# EAGLE design klingel_tueroeffner (EAGLE 6.2)
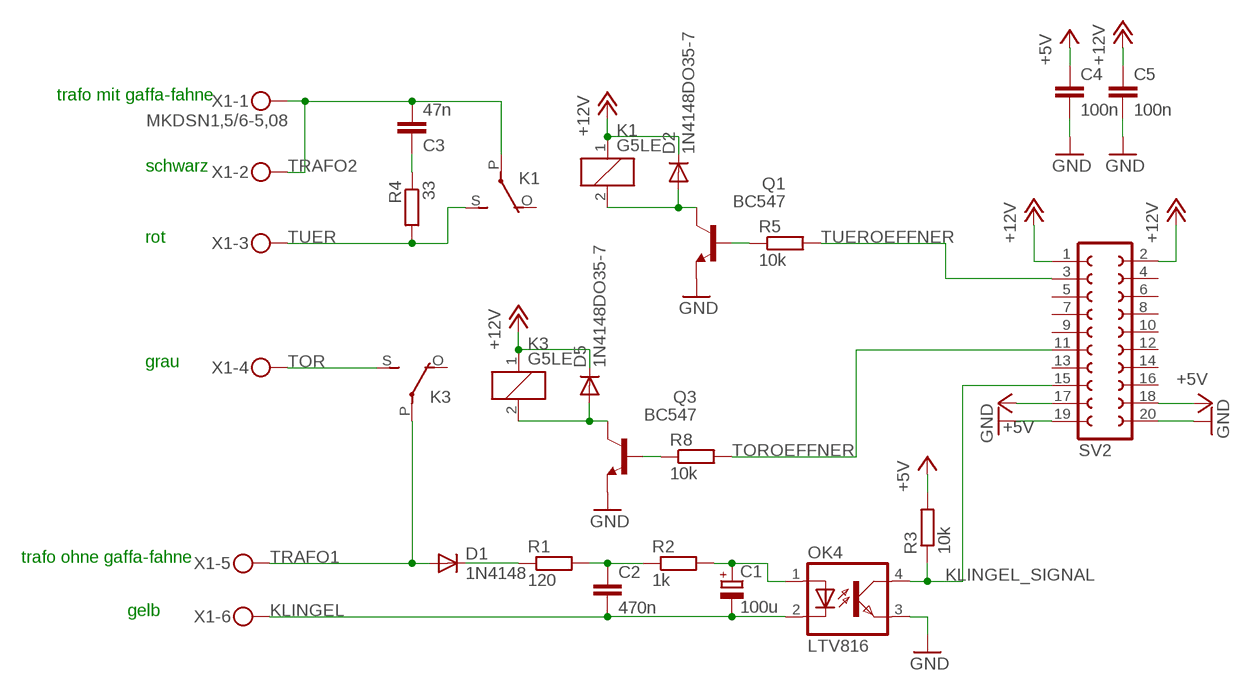
[diagram p0: schematic, sheet 1]

## Parts
C1  100u  CPOL-EUE2.5-6  [E2,5-6]
C2  470n  C-EU050-030X075  [C050-030X075]
C3  47n  C-EUC1206  [C1206]
C4  100n  C-EUC0805  [C0805]
C5  100n  C-EUC0805  [C0805]
D1  1N4148  1N4148DO35-7  [DO35-7]
D2  1N4148DO35-7  [DO35-7]
D5  1N4148DO35-7  [DO35-7]
K1  G5LE  [G5LE]
K3  G5LE  [G5LE]
OK4  LTV816  [DIL04]
Q1  BC547  [TO92]
Q3  BC547  [TO92]
R1  120  R-EU_R1206  [R1206]
R2  1k  R-EU_R1206  [R1206]
R3  10k  R-EU_R0805  [R0805]
R4  33  R-EU_R1206  [R1206]
R5  10k  R-EU_0204/7  [0204/7]
R8  10k  R-EU_R0805  [R0805]
SV2  FE10-2  [FE10-2]
X1  MKDSN1,5/6-5,08  [MKDSN1,5/6-5,08]

## Nets
+5V: C4.1 R3.2 SV2.17 SV2.18
+12V: C5.1 D2.C D5.C K1.1 K3.1 SV2.1 SV2.2
GND: C4.2 C5.2 OK4.3(EMIT) Q1.1(E) Q3.1(E) SV2.19 SV2.20
KLINGEL: C1.- C2.2 OK4.2(C) X1.6
KLINGEL_SIGNAL: OK4.4(COL) R3.1 SV2.15
N$2: C1.+ OK4.1(A) R2.2
N$4: D1.C R1.1
N$5: C2.1 R1.2 R2.1
N$6: C3.1 R4.1
N$9: Q1.2(B) R5.1
N$10: D2.A K1.2 Q1.3(C)
N$21: Q3.2(B) R8.1
N$22: D5.A K3.2 Q3.3(C)
TOR: K3.S(2:S) X1.4
TOROEFFNER: R8.2 SV2.11
TRAFO1: D1.A K3.P(2:P) X1.5
TRAFO2: C3.2 K1.P(2:P) X1.1 X1.2
TUER: K1.S(2:S) R4.2 X1.3
TUEROEFFNER: R5.2 SV2.3
Unconnected: K1.O(2:O) K3.O(2:O) SV2.4 SV2.5 SV2.6 SV2.7 SV2.8 SV2.9 SV2.10 SV2.12 SV2.13 SV2.14 SV2.16

## Notes on the sheet
- trafo mit gaffa-fahne
- schwarz
- rot
- grau
- trafo ohne gaffa-fahne
- gelb

## Library data of the parts
C1 = rcl:CPOL-EU: POLARIZED CAPACITOR, European symbol
C2-C5 = rcl:C-EU: CAPACITOR, European symbol
D1 D2 D5 = diode:1N4148: DIODE high speed (Philips)
K1 K3 = relay:G5LE: RELAY 1 x switch, 10 A/120 V AC, 8 A/30 V DC, Omron; OC_FARNELL: unknown; OC_NEWARK: unknown
OK4 = optocoupler:LTV816: OPTO COUPLER Source: LITEON, LTV816.pdf; OC_FARNELL: unknown; OC_NEWARK: unknown
Q1 Q3 = transistor-npn:BC547*: NPN Transistor
R1-R5 R8 = rcl:R-EU_: RESISTOR, European symbol
SV2 = con-lsta:FE10-2: FEMALE HEADER; OC_FARNELL: unknown; OC_NEWARK: unknown
X1 = con-phoenix-508:MKDSN1,5/6-5,08: MKDSN 1,5/ 6-5,08 Printklemme Nennstrom: 13,5 A Nennspannung: 250 V Rastermaß: 5,08 mm Polzahl: 6 Anschlussart: Schraubanschluss Montage: Löten Anschlussrichtung Leiter/Platine: 0 ° Artikelnummer: 1729160 Source: http://eshop.phoenixcontact.com .. 1729160.pdf; MPN: SMKDSN1,5/6-5,08; OC_FARNELL: 1792907; OC_NEWARK: 70R0302

## Board
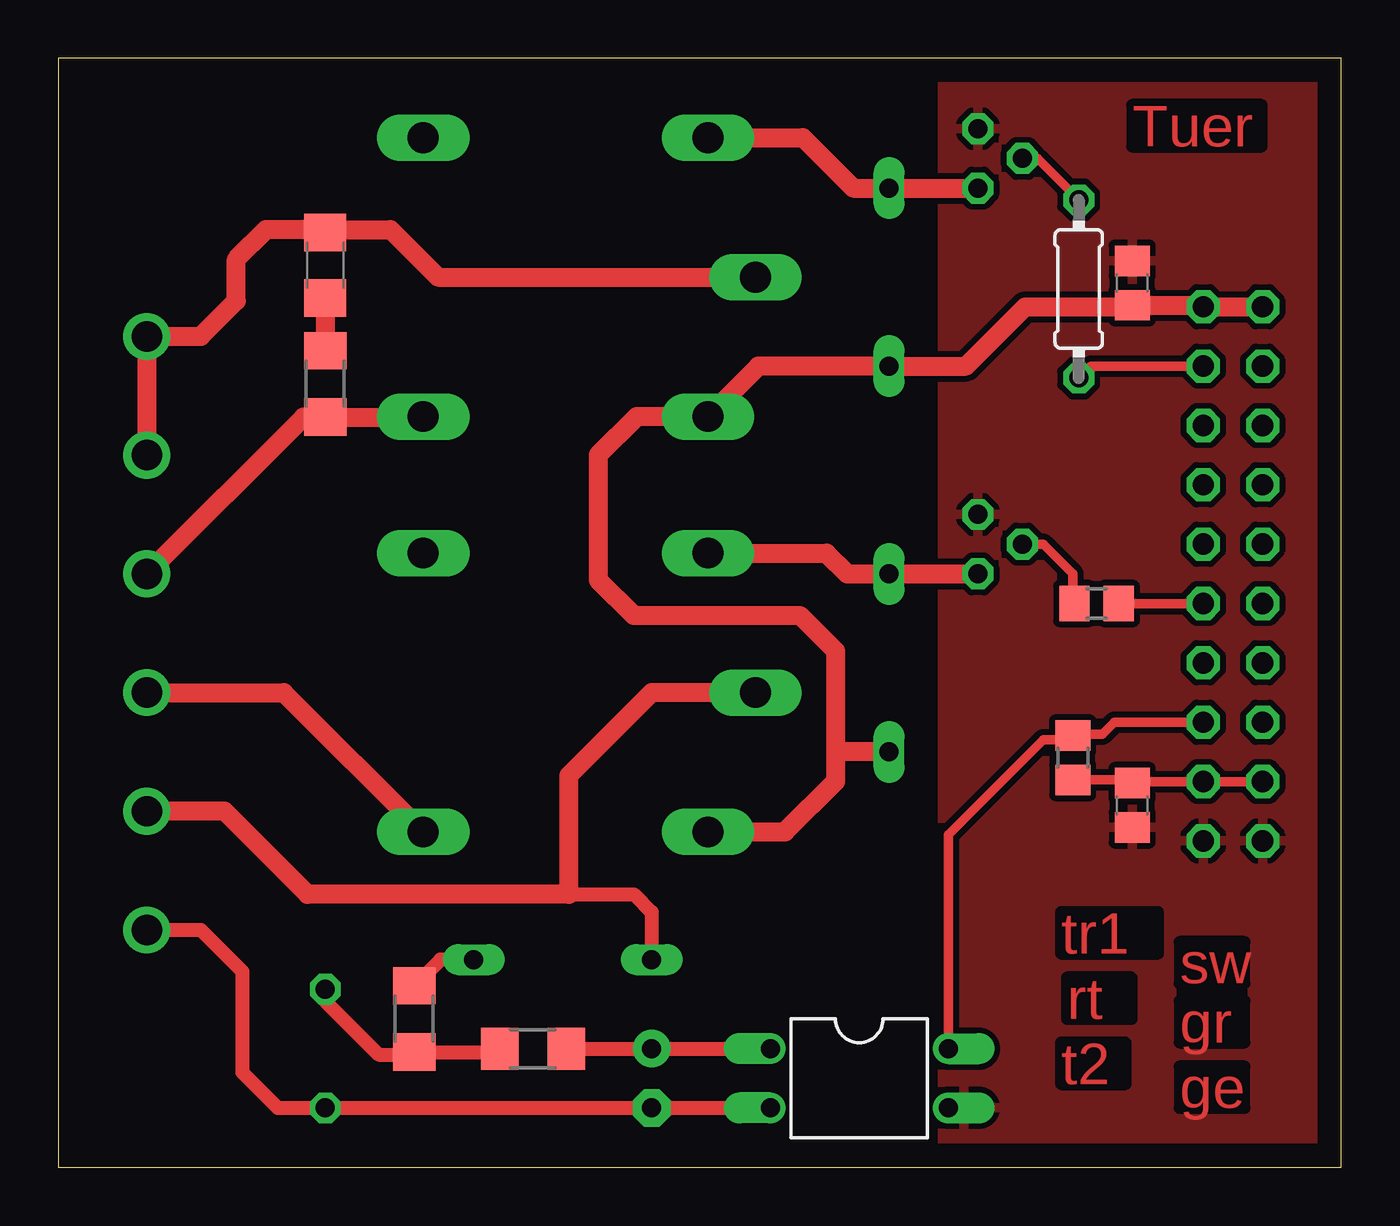
[diagram p1: board, top side]
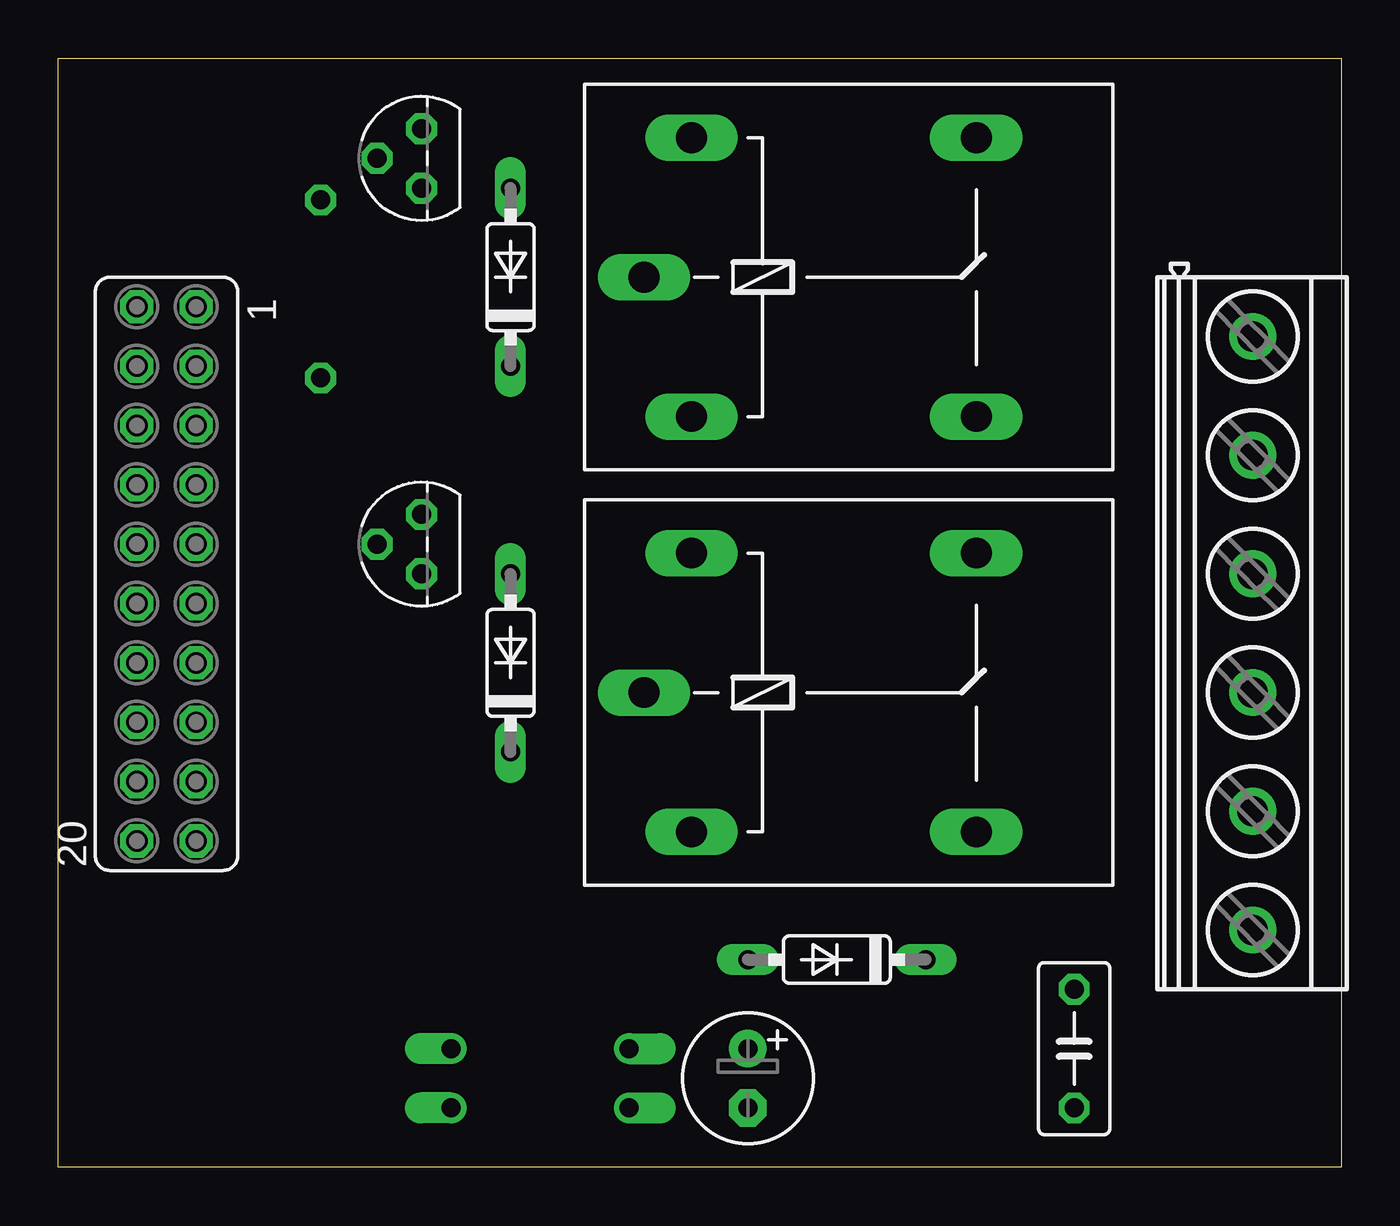
[diagram p2: board, bottom side, seen from below]

Size 54.92 x 47.46 mm. Coordinates in mm from the lower left corner, seen from the top.
Outline: 0,0 54.92,0 54.92,47.46 0,47.46 0,0
Copper layers (1*16): Top 0.035mm / dielectric 1.5mm / Bottom 0.035mm
Design rules: minimum track width 10mil, minimum drill 24mil, track to track 8mil, track to pad 8mil, pad to pad 8mil, via to via 8mil, smd to smd 8mil, copper to edge 40mil, drill to drill 8mil, minimum pad ring 10mil, minimum via ring 8mil, stop-mask expansion 4mil, vias tented up to drill 0mil, thermal gap 10mil

### Footprints (pad centres in the part's own frame; a part is rotated, then mirrored left to right if it is on the bottom)
E2,5-6 = drill 0.813 pad 1.6: + -1.27,0 | drill 0.813 pad 1.6 octagon: - 1.27,0
C050-030X075 = drill 0.813 octagon: 1 -2.54,0; 2 2.54,0
C1206 = smd 1.6 x 1.8: 1 -1.4,0; 2 1.4,0
C0805 = smd 1.3 x 1.5: 1 -0.95,0; 2 0.95,0
DO35-7 = drill 0.813 long: A 3.81,0; C -3.81,0
G5LE = drill 1.321 long: 1 -7.493,-5.969; 2 -7.493,5.969; O 4.699,5.969; P -9.525,0; S 4.699,-5.969
DIL04 = drill 0.813 offset: 1 -1.27,-3.81; 2 1.27,-3.81; 3 1.27,3.81; 4 -1.27,3.81
TO92 = drill 0.813 octagon: 1 1.27,0; 2 0,1.905; 3 -1.27,0
R1206 = smd 1.6 x 1.803: 1 -1.422,0; 2 1.422,0
R0805 = smd 1.3 x 1.5: 1 -0.95,0; 2 0.95,0
0204/7 = drill 0.813 octagon: 1 -3.81,0; 2 3.81,0
FE10-2 = drill 0.914 octagon: 1 -11.43,1.27; 2 -11.43,-1.27; 3 -8.89,1.27; 4 -8.89,-1.27; 5 -6.35,1.27; 6 -6.35,-1.27; 7 -3.81,1.27; 8 -3.81,-1.27; 9 -1.27,1.27; 10 -1.27,-1.27; 11 1.27,1.27; 12 1.27,-1.27; 13 3.81,1.27; 14 3.81,-1.27; 15 6.35,1.27; 16 6.35,-1.27; 17 8.89,1.27; 18 8.89,-1.27; 19 11.43,1.27; 20 11.43,-1.27
MKDSN1,5/6-5,08 = drill 1.3 pad 2: 1 -12.7,0.025; 2 -7.62,0.025; 3 -2.54,0.025; 4 2.54,0.025; 5 7.62,0.025; 6 12.7,0.025

### Placement (x,y rotation side)
C1  25.4,3.81 270 bottom
C2  11.43,5.08 270 bottom
C3  11.43,38.61 90 top
C4  45.97,15.49 270 top
C5  45.97,37.85 90 top
D1  21.59,8.89 180 bottom
D2  35.56,38.1 90 bottom
D5  35.56,21.59 90 bottom
K1  20.32,38.1 0 bottom
K3  20.32,20.32 0 bottom
OK4  34.29,3.81 270 top
Q1  39.37,43.18 90 bottom
Q3  39.37,26.67 90 bottom
R1  15.24,6.35 270 top
R2  20.32,5.08 0 top
R3  43.43,17.53 270 top
R4  11.43,33.53 270 top
R5  43.69,37.59 270 top
R8  44.45,24.13 0 top
SV2  50.29,25.4 270 bottom
X1  3.81,22.86 270 bottom

### Tracks (layer width: path | path; a pad name or v marks a point on that pad's centre or on a via)
+5V
  Top 0.406: SV2.18 SV2.17 46.04,16.51 C4.1 45.84,16.58 R3.2
+12V
  Top 0.813: 33.27,17.78 33.27,22.1 31.75,23.62 24.64,23.62 23.11,25.15 23.11,30.48 24.77,32.13 K1.1 29.97,34.29 D2.C 38.86,34.29 41.4,36.83 45.91,36.83 C5.1 48.96,36.9 SV2.1 SV2.2 | 33.27,17.78 33.27,16.51 31.11,14.35 K3.1 | D5.C 33.27,17.78
GND
  pour Top (isolate 0.254): 37.85,48.26 55.88,48.26 55.88,-1.27 37.85,-1.27
KLINGEL
  Top 0.61: OK4.2 C1.- C2.2 9.4,2.54 7.87,4.06 7.87,8.38 6.1,10.16 X1.6
KLINGEL_SIGNAL
  Top 0.406: SV2.15 45.21,19.05 44.7,18.54 43.5,18.54 R3.1 43.25,18.29 42.16,18.29 38.1,14.22 OK4.4
N$2
  Top 0.61: R2.2 C1.+ OK4.1
N$4
  Top 0.61: D1.C 16.36,8.89 R1.1
N$5
  Top 0.61: C2.1 11.43,7.11 13.72,4.83 15.14,4.83 R1.2 18.75,4.93 R2.1
N$6
  Top 0.813: C3.1 R4.1
N$9
  Top 0.406: Q1.2 41.91,43.18 R5.1
N$10
  Top 0.813: K1.2 31.88,44.07 34.04,41.91 D2.A Q1.3
N$21
  Top 0.406: Q3.2 42.16,26.67 43.43,25.4 43.43,24.2 R8.1
N$22
  Top 0.813: K3.2 32.89,26.29 33.78,25.4 D5.A Q3.3
TOR
  Top 0.813: X1.4 9.65,20.32 K3.S
TOROEFFNER
  Top 0.406: R8.2 SV2.11
TRAFO1
  Top 0.61: 21.84,11.68 24.64,11.68 25.4,10.92 D1.A
  Top 0.813: K3.P 25.4,20.32 21.84,16.76 21.84,11.68 10.67,11.68 7.11,15.24 X1.5
TRAFO2
  Top 0.813: X1.2 X1.1 6.1,35.56 7.62,37.08 7.62,38.86 8.89,40.13 11.31,40.13 | K1.P 16.26,38.1 14.22,40.13 11.31,40.13 | 11.31,40.13 C3.2
TUER
  Top 0.813: K1.S 15.6,32.11 R4.2 10.49,32.11 X1.3
TUEROEFFNER
  Top 0.406: SV2.3 44.2,34.29 R5.2

### Text on the board
Top: Tuer | tr1 | sw | rt | gr | t2 | ge